# Altium project ADH_XC7Z010_SoC.PrjPcb (part 5 of 10)
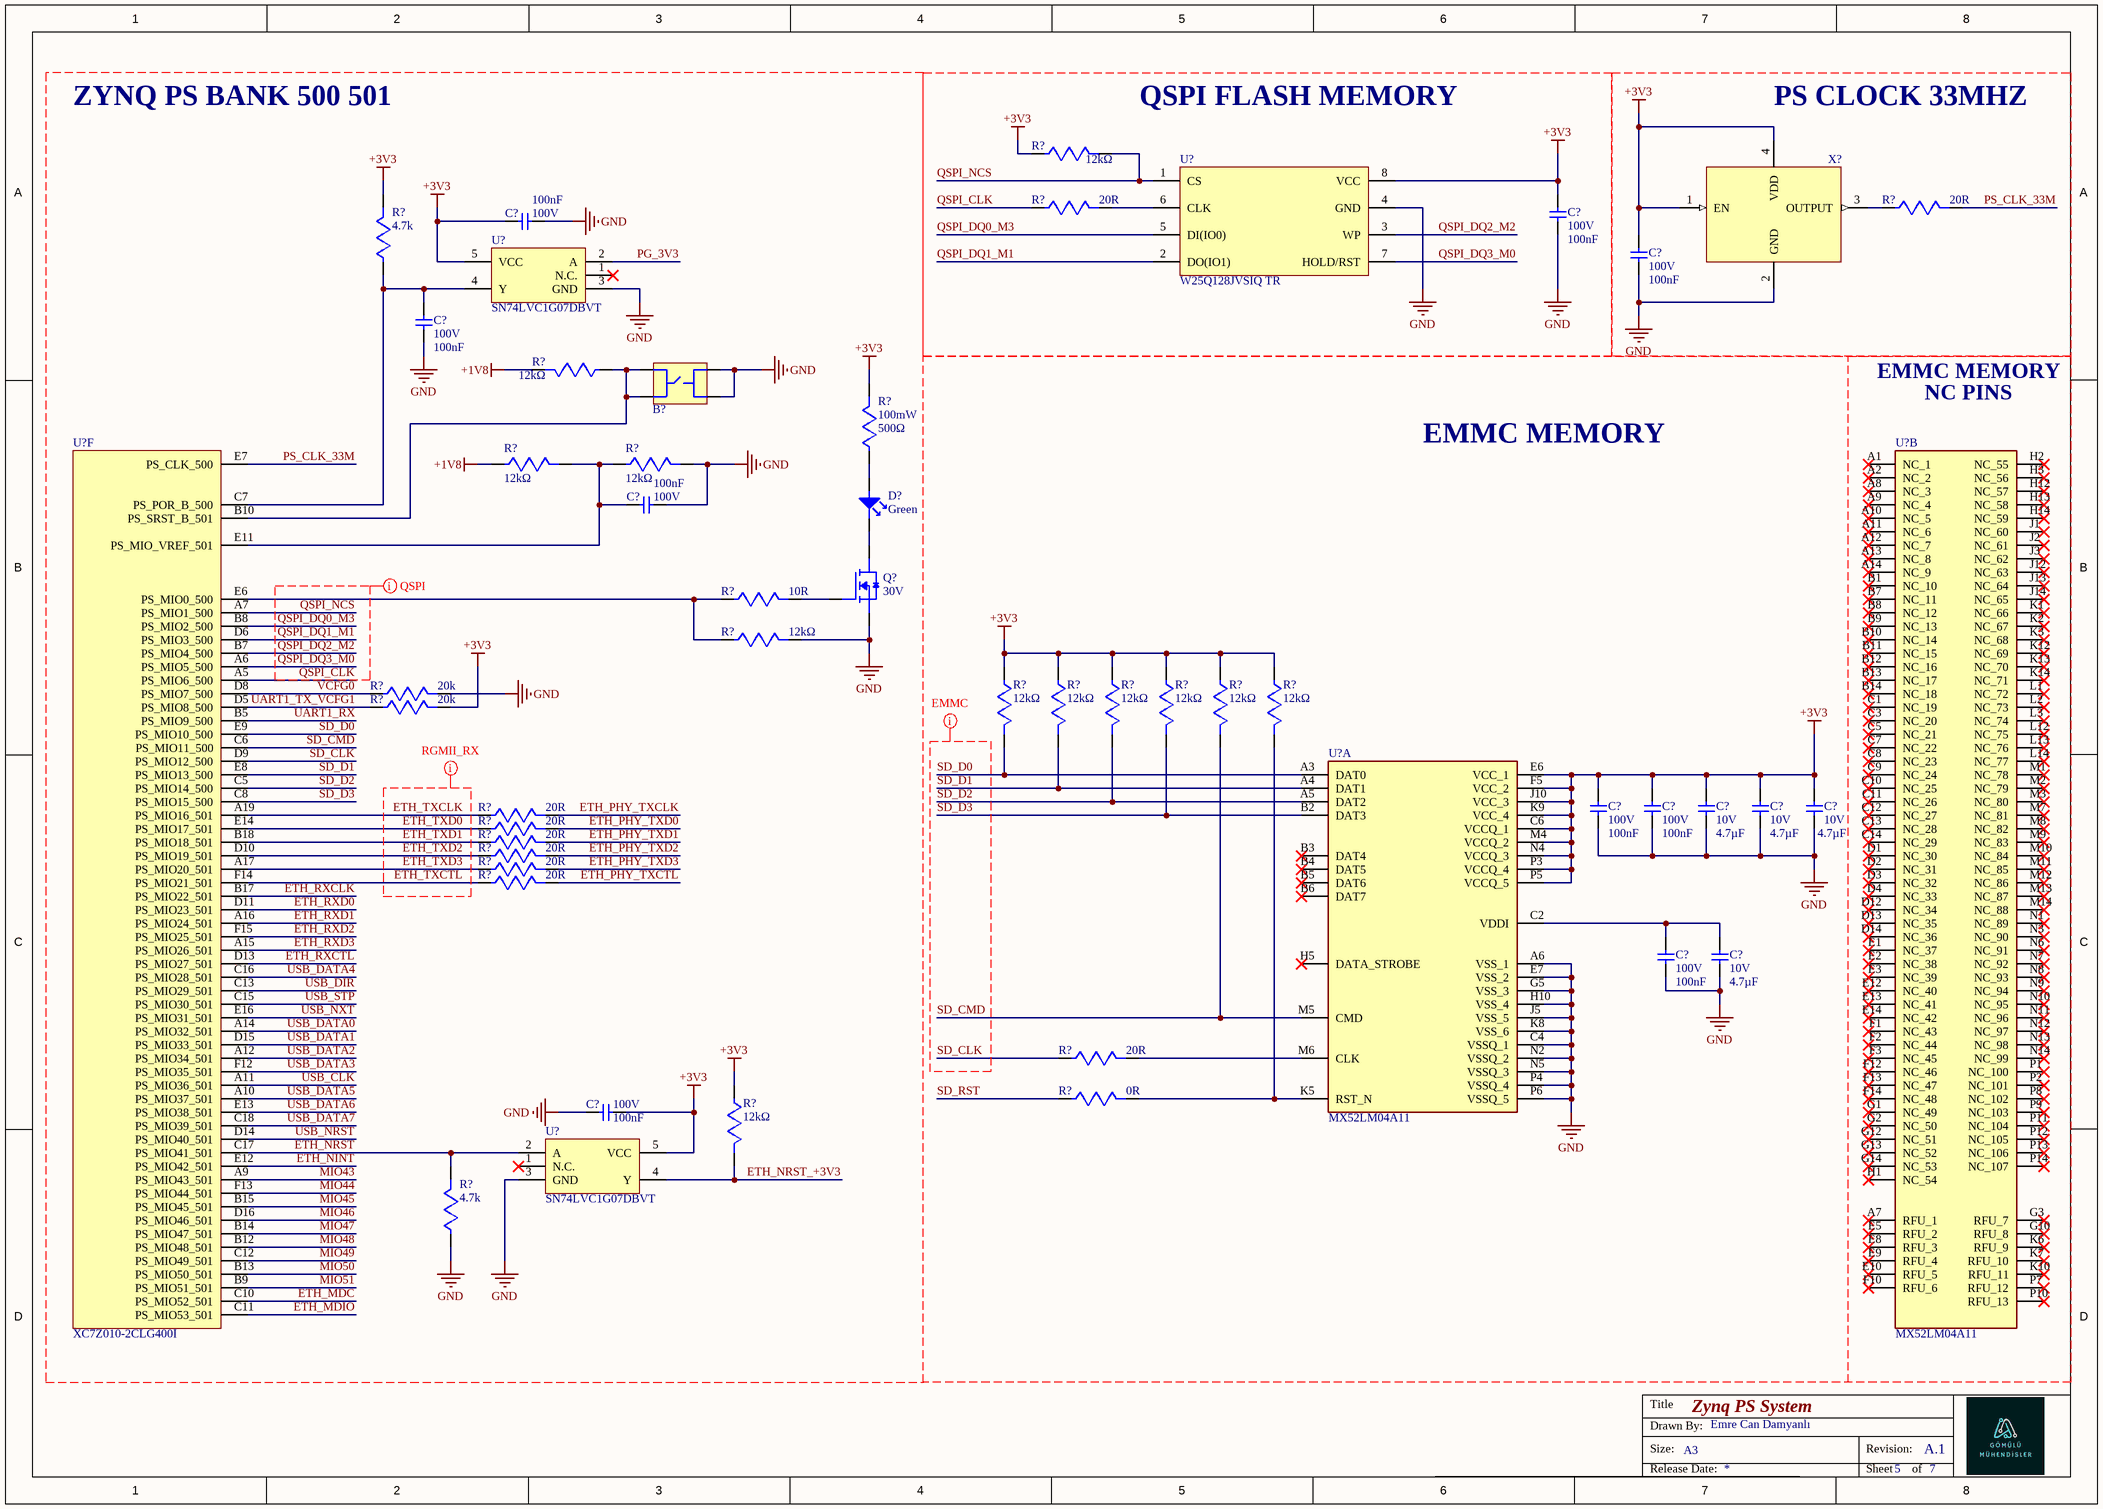
[diagram p10: Zynq_PS_System.SchDoc]

## Sheet Zynq_PS_System.SchDoc: Zynq PS System (continued)

### Nets
+1V8: R?#78.2 R?#80.1
+3V3: C?#116.2 C?#117.1 C?#118.1 C?#121.2 C?#122.2 C?#123.2 C?#124.2 C?#125.2 C?#128.2 R?#74.1 R?#77.2 R?#79.2 R?#85.1 R?#86.1 R?#87.1 R?#88.1 R?#89.1 R?#90.1 R?#91.2 R?#100.1 U?#14.8(VCC) U?#15.5(VCC) U?#18.C6(VCCQ_1) U?#18.E6(VCC_1) U?#18.F5(VCC_2) U?#18.J10(VCC_3) U?#18.K9(VCC_4) U?#18.M4(VCCQ_2) U?#18.N4(VCCQ_3) U?#18.P3(VCCQ_4) U?#18.P5(VCCQ_5) U?#19.5(VCC) X?#2.1(EN) X?#2.4(VDD)
GND: B?#2.3 B?#2.4 C?#116.1 C?#117.2 C?#118.2 C?#119.2 C?#120.1 C?#121.1 C?#122.1 C?#123.1 C?#124.1 C?#125.1 C?#126.1 C?#127.1 C?#128.1 Q?#6.2(S) R?#81.2 R?#83.2 R?#84.2 R?#101.1 U?#14.4(GND) U?#15.3(GND) U?#18.A6(VSS_1) U?#18.C4(VSSQ_1) U?#18.E7(VSS_2) U?#18.G5(VSS_3) U?#18.H10(VSS_4) U?#18.J5(VSS_5) U?#18.K8(VSS_6) U?#18.N2(VSSQ_2) U?#18.N5(VSSQ_3) U?#18.P4(VSSQ_4) U?#18.P6(VSSQ_5) U?#19.3(GND) X?#2.2(GND)
ETH_MDC: U?#16.C10(PS_MIO52_501)
ETH_MDIO: U?#16.C11(PS_MIO53_501)
ETH_NINT: U?#16.E12(PS_MIO42_501)
ETH_NRST: R?#101.2 U?#16.C17(PS_MIO41_501) U?#19.2(A)
ETH_NRST_+3V3: R?#100.2 U?#19.4(Y)
ETH_PHY_TXCLK: R?#92.2
ETH_PHY_TXCTL: R?#97.2
ETH_PHY_TXD0: R?#93.2
ETH_PHY_TXD1: R?#94.2
ETH_PHY_TXD2: R?#95.2
ETH_PHY_TXD3: R?#96.2
ETH_RXCLK: U?#16.B17(PS_MIO22_501)
ETH_RXCTL: U?#16.D13(PS_MIO27_501)
ETH_RXD0: U?#16.D11(PS_MIO23_501)
ETH_RXD1: U?#16.A16(PS_MIO24_501)
ETH_RXD2: U?#16.F15(PS_MIO25_501)
ETH_RXD3: U?#16.A15(PS_MIO26_501)
ETH_TXCLK: R?#92.1 U?#16.A19(PS_MIO16_501)
ETH_TXCTL: R?#97.1 U?#16.F14(PS_MIO21_501)
ETH_TXD0: R?#93.1 U?#16.E14(PS_MIO17_501)
ETH_TXD1: R?#94.1 U?#16.B18(PS_MIO18_501)
ETH_TXD2: R?#95.1 U?#16.D10(PS_MIO19_501)
ETH_TXD3: R?#96.1 U?#16.A17(PS_MIO20_501)
MIO43: U?#16.A9(PS_MIO43_501)
MIO44: U?#16.F13(PS_MIO44_501)
MIO45: U?#16.B15(PS_MIO45_501)
MIO46: U?#16.D16(PS_MIO46_501)
MIO47: U?#16.B14(PS_MIO47_501)
MIO48: U?#16.B12(PS_MIO48_501)
MIO49: U?#16.C12(PS_MIO49_501)
MIO50: U?#16.B13(PS_MIO50_501)
MIO51: U?#16.B9(PS_MIO51_501)
PG_3V3: U?#15.2(A)
PS_CLK_33M: R?#76.2 U?#16.E7(PS_CLK_500)
QSPI_CLK: R?#75.1 U?#16.A5(PS_MIO6_500)
QSPI_DQ0_M3: U?#14.5(DI(IO0)) U?#16.B8(PS_MIO2_500)
QSPI_DQ1_M1: U?#14.2(DO(IO1)) U?#16.D6(PS_MIO3_500)
QSPI_DQ2_M2: U?#14.3(WP) U?#16.B7(PS_MIO4_500)
QSPI_DQ3_M0: U?#14.7(HOLD/RST) U?#16.A6(PS_MIO5_500)
QSPI_NCS: R?#74.2 U?#14.1(CS) U?#16.A7(PS_MIO1_500)
SD_CLK: R?#98.1 U?#16.D9(PS_MIO12_500)
SD_CMD: R?#89.2 U?#16.C6(PS_MIO11_500) U?#18.M5(CMD)
SD_D0: R?#85.2 U?#16.E9(PS_MIO10_500) U?#18.A3(DAT0)
SD_D1: R?#86.2 U?#16.E8(PS_MIO13_500) U?#18.A4(DAT1)
SD_D2: R?#87.2 U?#16.C5(PS_MIO14_500) U?#18.A5(DAT2)
SD_D3: R?#88.2 U?#16.C8(PS_MIO15_500) U?#18.B2(DAT3)
SD_RST: R?#99.1
UART1_RX: U?#16.B5(PS_MIO9_500)
UART1_TX_VCFG1: R?#91.1 U?#16.D5(PS_MIO8_500)
USB_CLK: U?#16.A11(PS_MIO36_501)
USB_DATA0: U?#16.A14(PS_MIO32_501)
USB_DATA1: U?#16.D15(PS_MIO33_501)
USB_DATA2: U?#16.A12(PS_MIO34_501)
USB_DATA3: U?#16.F12(PS_MIO35_501)
USB_DATA4: U?#16.C16(PS_MIO28_501)
USB_DATA5: U?#16.A10(PS_MIO37_501)
USB_DATA6: U?#16.E13(PS_MIO38_501)
USB_DATA7: U?#16.C18(PS_MIO39_501)
USB_DIR: U?#16.C13(PS_MIO29_501)
USB_NRST: U?#16.D14(PS_MIO40_501)
USB_NXT: U?#16.E16(PS_MIO31_501)
USB_STP: U?#16.C15(PS_MIO30_501)
VCFG0: R?#84.1 U?#16.D8(PS_MIO7_500)
NetB?#2_1: B?#2.1 B?#2.2 R?#78.1 U?#16.B10(PS_SRST_B_501)
NetC?#119_1: C?#119.1 R?#77.1 U?#15.4(Y) U?#16.C7(PS_POR_B_500)
NetC?#120_2: C?#120.2 R?#80.2 R?#81.1 U?#16.E11(PS_MIO_VREF_501)
NetC?#126_2: C?#126.2 C?#127.2 U?#18.C2(VDDI)
NetD?#7_1: D?#7.1 R?#79.1
NetD?#7_2: D?#7.2 Q?#6.3(D)
NetQ?#6_1: Q?#6.1(G) R?#82.2
NetR?#75_2: R?#75.2 U?#14.6(CLK)
NetR?#76_1: R?#76.1 X?#2.3(OUTPUT)
NetR?#82_1: R?#82.1 R?#83.1 U?#16.E6(PS_MIO0_500)
NetR?#90_2: R?#90.2 R?#99.2 U?#18.K5(RST_N)
NetR?#98_2: R?#98.2 U?#18.M6(CLK)

Not connected (* = marked no-connect by the designer): U?#15 1(N.C.)*; U?#17 A1(NC_1)* A2(NC_2)* A7(RFU_1)* A8(NC_3)* A9(NC_4)* A10(NC_5)* A11(NC_6)* A12(NC_7)* A13(NC_8)* A14(NC_9)* B1(NC_10)* B7(NC_11)* B8(NC_12)* B9(NC_13)* B10(NC_14)* B11(NC_15)* B12(NC_16)* B13(NC_17)* B14(NC_18)* C1(NC_19)* C3(NC_20)* C5(NC_21)* C7(NC_22)* C8(NC_23)* C9(NC_24)* C10(NC_25)* C11(NC_26)* C12(NC_27)* C13(NC_28)* C14(NC_29)* D1(NC_30)* D2(NC_31)* D3(NC_32)* D4(NC_33)* D12(NC_34)* D13(NC_35)* D14(NC_36)* E1(NC_37)* E2(NC_38)* E3(NC_39)* E5(RFU_2)* E8(RFU_3)* E9(RFU_4)* E10(RFU_5)* E12(NC_40)* E13(NC_41)* E14(NC_42)* F1(NC_43)* F2(NC_44)* F3(NC_45)* F10(RFU_6)* F12(NC_46)* F13(NC_47)* F14(NC_48)* G1(NC_49)* G2(NC_50)* G3(RFU_7)* G10(RFU_8)* G12(NC_51)* G13(NC_52)* G14(NC_53)* H1(NC_54)* H2(NC_55)* H3(NC_56)* H12(NC_57)* H13(NC_58)* H14(NC_59)* J1(NC_60)* J2(NC_61)* J3(NC_62)* J12(NC_63)* J13(NC_64)* J14(NC_65)* K1(NC_66)* K2(NC_67)* K3(NC_68)* K6(RFU_9)* K7(RFU_10)* K10(RFU_11)* K12(NC_69)* K13(NC_70)* K14(NC_71)* L1(NC_72)* L2(NC_73)* L3(NC_74)* L12(NC_75)* L13(NC_76)* L14(NC_77)* M1(NC_78)* M2(NC_79)* M3(NC_80)* M7(NC_81)* M8(NC_82)* M9(NC_83)* M10(NC_84)* M11(NC_85)* M12(NC_86)* M13(NC_87)* M14(NC_88)* N1(NC_89)* N3(NC_90)* N6(NC_91)* N7(NC_92)* N8(NC_93)* N9(NC_94)* N10(NC_95)* N11(NC_96)* N12(NC_97)* N13(NC_98)* N14(NC_99)* P1(NC_100)* P2(NC_101)* P7(RFU_12)* P8(NC_102)* P9(NC_103)* P10(RFU_13)* P11(NC_104)* P12(NC_105)* P13(NC_106)* P14(NC_107)*; U?#18 B3(DAT4)* B4(DAT5)* B5(DAT6)* B6(DAT7)* H5(DATA_STROBE)*; U?#19 1(N.C.)*

### Layout directives
mark named RGMII_RX: ETH_TXCLK, ETH_TXCTL, ETH_TXD0, ETH_TXD1, ETH_TXD2, ETH_TXD3
mark named QSPI: QSPI_CLK, QSPI_DQ0_M3, QSPI_DQ1_M1, QSPI_DQ2_M2, QSPI_DQ3_M0, QSPI_NCS
mark named EMMC: SD_CLK, SD_CMD, SD_D0, SD_D1, SD_D2, SD_D3

### Notes on the sheet
- ZYNQ PS BANK 500 501
- QSPI FLASH MEMORY
- PS CLOCK 33MHZ
- EMMC MEMORY
- NC PINS
- Title
- Size:
- Drawn By:
- A3
- Revision:
- Release Date:
- Sheet
- of